# Altium schematic sheet Driver.SchDoc
size A4; SheetNumber: 1; SheetTotal: 1
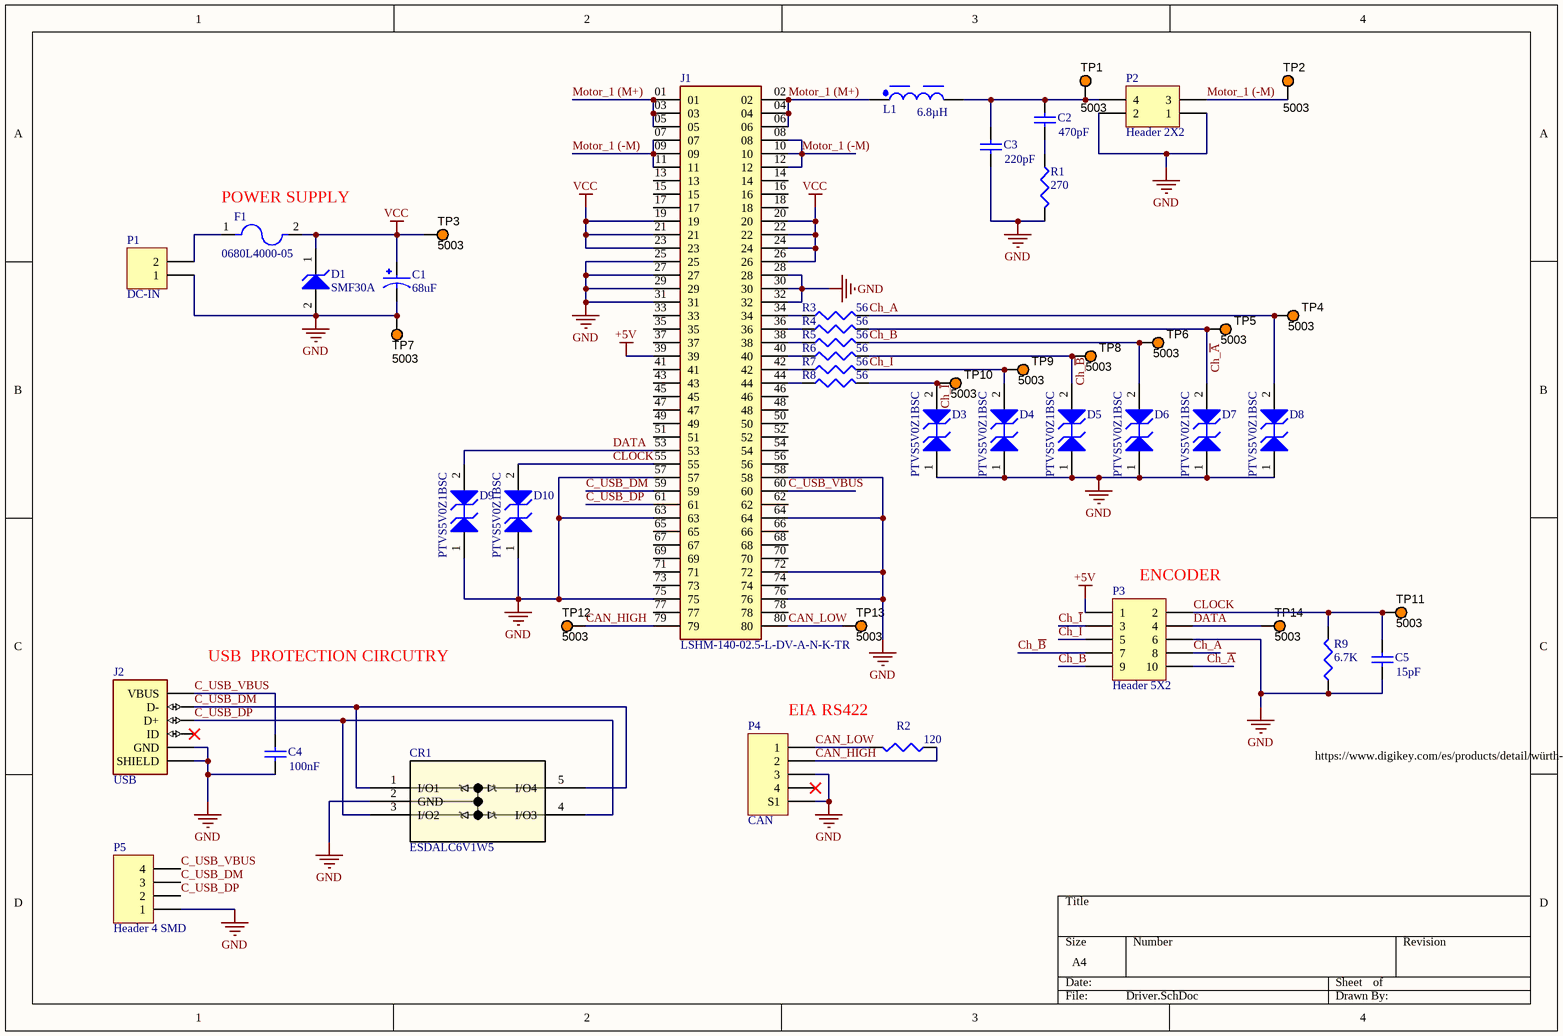
[diagram p0: Driver.SchDoc]

## Parts
C1  68uF  [CAP_50SVT68M]
C2  value 470pF  [1608[0603]]  (hidden comment: Cap Semi)
C3  value 220pF  [1608[0603]]  (hidden comment: Cap Semi)
C4  value 100nF  [1608[0603]]  (hidden comment: Cap Semi)
C5  value 15pF  [1608[0603]]  (hidden comment: Cap Semi)
CR1  ESDALC6V1W5  [ESDALC6V1W5-Footprint-1]
D1  SMF30A  [ONSC-SOD-123FL-2-498_V]
D3  PTVS5V0Z1BSC  [SOD993B]
D4  PTVS5V0Z1BSC  [SOD993B]
D5  PTVS5V0Z1BSC  [SOD993B]
D6  PTVS5V0Z1BSC  [SOD993B]
D7  PTVS5V0Z1BSC  [SOD993B]
D8  PTVS5V0Z1BSC  [SOD993B]
D9  PTVS5V0Z1BSC  [SOD993B]
D10  PTVS5V0Z1BSC  [SOD993B]
F1  0680L4000-05  [FUSC6125X279N]
J1  LSHM-140-02.5-L-DV-A-N-K-TR  [SAMTEC_LSHM-140-02.5-L-DV-A-N-K-TR]
J2  USB  [GCT_USB3076-XX-X_REVC]
L1  6.8µH  [WE-XHMA_6060]
P1  DC-IN  [Header 2-Footprint-1]
P2  Header 2X2  [MOLEX_1724480004]
P3  Header 5X2  [CONN_HIF3FC-14PA-2.54DS(71)_HIR]
P4  CAN  [MOLEX_5025850470]
P5  Header 4 SMD  [Header 4 SMD]
R1  value 270  [J1-0603]  (hidden comment: Res3)
R2  value 120  [J1-0603]  (hidden comment: Res3)
R3  value 56  [J1-0603]  (hidden comment: Res3)
R4  value 56  [J1-0603]  (hidden comment: Res3)
R5  value 56  [J1-0603]  (hidden comment: Res3)
R6  value 56  [J1-0603]  (hidden comment: Res3)
R7  value 56  [J1-0603]  (hidden comment: Res3)
R8  value 56  [J1-0603]  (hidden comment: Res3)
R9  value 6.7K  [J1-0603]  (hidden comment: Res3)
TP1  5003  [KSTN-5003]
TP2  5003  [KSTN-5003]
TP3  5003  [KSTN-5003]
TP4  5003  [KSTN-5003]
TP5  5003  [KSTN-5003]
TP6  5003  [KSTN-5003]
TP7  5003  [KSTN-5003]
TP8  5003  [KSTN-5003]
TP9  5003  [KSTN-5003]
TP10  5003  [KSTN-5003]
TP11  5003  [KSTN-5003]
TP12  5003  [KSTN-5003]
TP13  5003  [KSTN-5003]
TP14  5003  [KSTN-5003]

## Nets
+5V: J1.39 P3.1
GND: C1.2 C3.2 C4.2 C5.2 CR1.2(GND) D1.2(A) D3.1(A1) D4.1(A1) D5.1(A1) D6.1(A1) D7.1(A1) D8.1(A1) D9.1(A1) D10.1(A1) J1.25 J1.27 J1.28 J1.29 J1.30 J1.31 J1.32 J1.57 J1.58 J1.63 J1.64 J1.72 J1.75 J1.76 J2.5(GND) J2.6(SHIELD) P1.1 P2.1 P2.2 P3.6 P4.3 P4.S1 P5.1 R1.2 R9.1 TP7.1
VCC: C1.1 D1.1(K) F1.2 J1.19 J1.20 J1.21 J1.22 J1.23 J1.24 J1.26 TP3.1
C_USB_DM: CR1.1(I/O1) CR1.5(I/O4) J1.59 J2.2(D-) P5.3
C_USB_DP: CR1.3(I/O2) CR1.4(I/O3) J1.61 J2.3(D+) P5.2
C_USB_VBUS: C4.1 J1.60 J2.1(VBUS) P5.4
CAN_HIGH: J1.79 P4.2 R2.1 TP12.1
CAN_LOW: J1.80 P4.1 R2.2 TP13.1
Ch_A: D8.2(A2) P3.8 R3.2 TP4.1
Ch_~{A}: D7.2(A2) P3.10 R4.2 TP5.1
Ch_B: D6.2(A2) P3.9 R5.2 TP6.1
Ch_~{B}: D5.2(A2) P3.7 R6.2 TP8.1
Ch_I: D4.2(A2) P3.5 R7.2 TP9.1
Ch_~{I}: D3.2(A2) P3.3 R8.2 TP10.1
CLOCK: C5.1 D10.2(A2) J1.55 P3.2 R9.2 TP11.1
DATA: D9.2(A2) J1.53 P3.4 TP14.1
Motor_1 (-M): J1.07 J1.08 J1.09 J1.10 J1.11 J1.12 P2.3 TP2.1
Motor_1 (M+): J1.01 J1.02 J1.03 J1.04 J1.05 J1.06 L1.1
NetC2_1: C2.1 C3.1 L1.2 P2.4 TP1.1
NetC2_2: C2.2 R1.1
NetF1_1: F1.1 P1.2
NetJ1_34: J1.34 R3.1
NetJ1_36: J1.36 R4.1
NetJ1_38: J1.38 R5.1
NetJ1_40: J1.40 R6.1
NetJ1_42: J1.42 R7.1
NetJ1_44: J1.44 R8.1

Not connected (* = marked no-connect by the designer): J1 13 14 15 16 17 18 33 35 37 41 43 45 46 47 48 49 50 51 52 54 56 62 65 66 67 68 69 70 71 73 74 77 78; J2 4(ID)*; P4 4*

## Notes on the sheet
- (near F1) POWER SUPPLY
- (near P3) ENCODER
- (near J2) USB  PROTECTION CIRCUTRY
- EIA RS422
- https://www.digikey.com/es/products/detail/würth-elektronik/9774050243R/5320640?s=N4IgTCBcDaIJwHYEBYAMBWVZkGYBKIAugL5A

## Library data of the parts
C1 = 50SVT68M: Package: None; MP: 50SVT68M; Price: None; Availability: Unavailable; Value: *
C2-C5 = Cap Semi: Capacitor (Semiconductor SIM Model); Published: 8-Jun-2000; LatestRevisionDate: 29-May-2009; LatestRevisionNote: IPC-7351 Footprint Added.; PackageReference: C1206; Publisher: Altium Limited; PackageDescription: Chip Capacitor
CR1 = CMP-009-000000-3: No Description Available; Mfr_Name: STMicroelectronics; Type: DEV; RefDes: RefDes; Design Item ID: ESDALC6V1W5; Copyright: Copyright (C) 2022 Ultra Librarian. All rights reserved.; Component Type: Standard; Pin Count: 5; Source: DriverPCB.SCHLIB; Manufacturer_Part_Number: ESDALC6V1W5
D1 = SMF30AT1G: 200 W Transient Voltage Suppressor, 2-Pin SOD-123FL, Pb-Free, Tape and Reel; Manufacturer: On Semiconductor; Direction: Unidirectional; IR Max (uA): 1; V(BR) Typ (V): 35.1; DatasheetVersion: Rev. 7; PackageVersion: Rev. D, 05/2013; PackageReference: SOD-123FL-2-498; PackageDescription: 2-Pin SOD, Body 1.65 x 2.7 mm; Supplier 1: Digi-Key; Supplier Part Number 1: SMF30AT1GOSTR-ND; Supplier 2: Digi-Key; Supplier Part Number 2: SMF30AT1GOSCT-ND; Supplier 3: Digi-Key; Supplier Part Number 3: SMF30AT1GOSDKR-ND; Supplier 4: Farnell; Supplier Part Number 4: 2317489; Supplier 5: Newark; Supplier Part Number 5: 09R9720; Supplier 6: Newark; Supplier Part Number 6: 42K2628; Supplier 7: Mouser; Supplier Part Number 7: 863-SMF30AT1G; Packing: Tape and Reel; RoHS: Pb-Free; Mounting Technology: Surface Mount; PartNumber: SMF30AT1G; ComponentLink1Description: Manufacturer URL; ComponentLink1URL: http://www.onsemi.com/; ComponentLink2Description: Datasheet; ComponentLink2URL: http://www.onsemi.com/pub_link/Collateral/SMF5.0AT1-D.PDF; ComponentLink3Description: Package Specification; ComponentLink3URL: http://www.onsemi.com/pub_link/Collateral/498-01.PDF
D3-D10 = PTVS5V0Z1BSC: Manufacturer: On Semiconductor; PartNumber: 1SMB16CAT3; Direction: Bidirectional; IR Max (uA): 5; Packing: Tape and Reel; PPK Max (W): 600; V(BR) Typ (V): 18.74; DatasheetVersion: Rev. A; PackageVersion: Rev. A, 01/2000; PackageReference: SMB-2-403C-01; PackageDescription: 2-Pin Small Molded Package, J-Bend Lead, Body 4.315 x 3.555 mm; Supplier 1: Digi-Key; Supplier Part Number 1: 1SMB16CAT3OSTR-ND; Supplier 2: Digi-Key; Supplier Part Number 2: 1SMB16CAT3OSCT-ND; Supplier 3: Digi-Key; Supplier Part Number 3: 1SMB16CAT3OSDKR-ND; Mounting Technology: Surface Mount; ComponentLink1Description: Manufacturer URL; ComponentLink1URL: http://www.onsemi.com/; ComponentLink2Description: Datasheet; ComponentLink2URL: http://www.onsemi.com/pub_link/Collateral/1SMB10CAT3-D.PDF; ComponentLink3Description: Package Specification; ComponentLink3URL: http://www.onsemi.com/pub_link/Collateral/1SMB10CAT3-D.PDF
F1 = 0680L4000-05: Surface mount bricks | Silver Plated | 2410 case size | Slow Blow | 4A | Tape and Reel (5000 pcs.); MF: Bel Fuse; SnapEDA_Link: https://www.snapeda.com/parts/0680L4000-05/Bel+Fuse/view-part/?ref=snap; Purchase-URL: https://pricing.snapeda.com/search/part/0680L4000-05/?ref=eda; Availability: In Stock; MP: 0680L4000-05; Value: *; Price: None; Package: SMD-2 Bel Fuse Inc.; Check_prices: https://www.snapeda.com/parts/0680L4000-05/Bel+Fuse/view-part/?ref=eda
J1 = LSHM-140-02.5-L-DV-A-N-K-TR: LSHM - Samtec 0.50mm Razor Beam High-Speed Hermaphroditic Terminal / Socket Strip.; Price: None; MP: LSHM-140-02.5-L-DV-A-N-K-TR; Availability: Unavailable; Value: *; Package: None
J2 = USB3076-XX-X_REVC: Micro USB Receptacle, Type B, SMT, Horizontal, Bottom Mount w/out Peg, w/out Shell Stakes, w/out Mating Face Lead-In; Package: None; Availability: Unavailable; Value: *; MP: USB3076-XX-X_REVC; Price: None
L1 = 78439369068: WE-XHMA SMD Power Inductor, size 1090, 6.8µH, 10.5A, 7.16mΩ; Manufacturer: Wurth Elektronik; Case/Size Code: 1090; Inductance Tolerance: 20%; Saturation Current: 23.25A; Self Resonant Frequency: 16MHz; ComponentLink1Description: Website Link; ComponentLink1URL: https://www.we-online.com/redexpert/article/78439369068?ad; ComponentLink2Description: Datasheet Link; ComponentLink2URL: https://www.we-online.com/redexpert/spec/78439369068?ad; Manufacturer Part Number: 78439369068; Category: Shielded Power Inductors; Match Code: WE-XHMA; Mount: Surface Mount; Operating Temperature Max: 125°C; Operating Temperature Min: -40°C; Packaging: Tape and Reel; Length: 11.6mm; Width: 10.5mm; Height: 8.8mm; DC Resistance: 7.16mΩ; Inductance: 6.8µH; Rated Current: 10.5A
P1 = CMP-004-000000-3: Header, 2-Pin; LatestRevisionDate: 17-Jul-2002; Source: DriverPCB.SCHLIB; Component Type: Standard; Pin Count: 2; LatestRevisionNote: Re-released for DXP Platform.; Publisher: Altium Limited; Design Item ID: Header 2
P2 = CMP-004-000001-2: Header, 2-Pin, Dual row; LatestRevisionNote: Re-released for DXP Platform.; Publisher: Altium Limited; Source: DriverPCB.SCHLIB; Design Item ID: Header 2X2; LatestRevisionDate: 17-Jul-2002; Component Type: Standard; Pin Count: 4
P3 = Header 5X2: Header, 5-Pin, Dual row; LatestRevisionDate: 17-Jul-2002; LatestRevisionNote: Re-released for DXP Platform.; Publisher: Altium Limited
P4 = Header 5: Header, 5-Pin; LatestRevisionDate: 17-Jul-2002; LatestRevisionNote: Re-released for DXP Platform.; Publisher: Altium Limited; Part Number: *
P5 = Header 4 SMD: Header, 4-Pin; LatestRevisionDate: 17-Jul-2002; LatestRevisionNote: Re-released for DXP Platform.; Publisher: Altium Limited
R1-R9 = Res3: Resistor; Published: 8-Jun-2000; LatestRevisionDate: 29-May-2009; LatestRevisionNote: IPC-7351 Footprint Added.; PackageReference: J1-0603; Publisher: Altium Limited; PackageDescription: Chip Resistor
TP1-TP14 = CMP-002-00037-2: Test Point, Orange, Height 4.6 mm, Tail Length 3 mm, 1-Pin THD, RoHS; Manufacturer: Keystone; Colour: Orange; Packaging: Bulk; Package Description: 1-Pin Through Hole Device, Dia 2.54 mm; Pins: 1; Package Reference: 5003; Datasheet Version: Jun-15; Case/Package: 5003; Mounting Technology: TH; Connector Type: TestPoint; Diameter: 2.54mm; Contact Material: Bronze; Datasheet URL: http://keyelco.com/userAssets/file/M65p56.pdf; Manufacturer URL: http://www.keyelco.com/; Package Quantity: 10; Contact Plating: Tin; RoHS Compliant: True